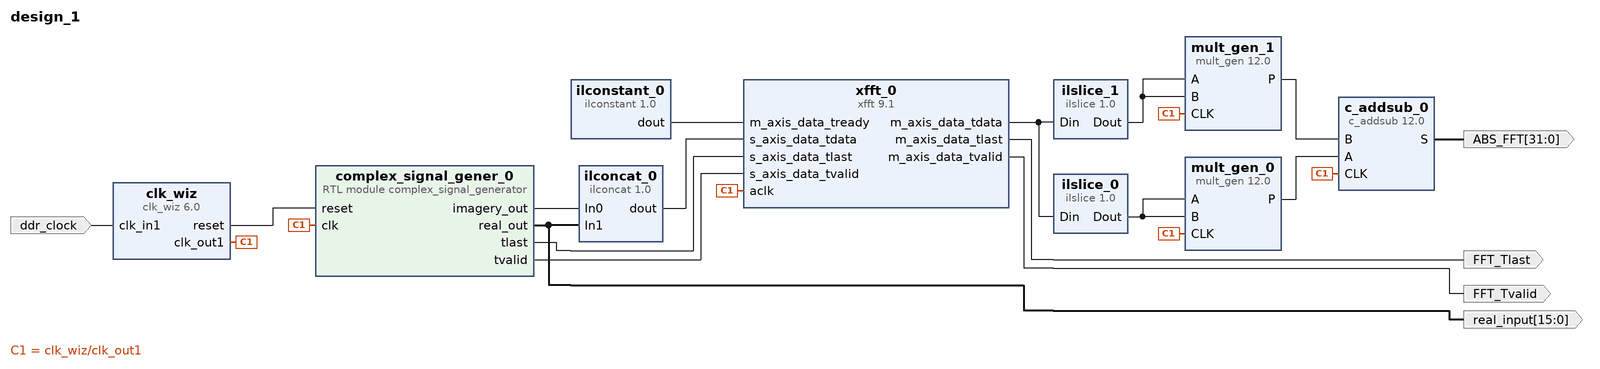
[diagram p0: block diagram of the top level]
# Vivado block design design_1, xc7s25csga324-1, Vivado 2025.1
create_bd_design design_1

create_bd_port -dir O -from 31 -to 0 -type data ABS_FFT
create_bd_port -dir O FFT_Tlast
create_bd_port -dir O FFT_Tvalid
create_bd_port -dir O -from 15 -to 0 real_input
create_bd_port -dir I -type clk ddr_clock
set_property -dict {CONFIG.FREQ_HZ 100000000 CONFIG.PHASE 0.0} [get_bd_ports ddr_clock]

create_bd_cell -type ip -vlnv xilinx.com:ip:xfft:9.1 xfft_0
set_property -dict [list \
  CONFIG.butterfly_type use_luts \
  CONFIG.data_format fixed_point \
  CONFIG.implementation_options automatically_select \
  CONFIG.input_width 16 \
  CONFIG.number_of_stages_using_block_ram_for_data_and_phase_factors 4 \
  CONFIG.output_ordering natural_order \
  CONFIG.phase_factor_width 16 \
  CONFIG.run_time_configurable_transform_length false \
  CONFIG.super_sample_rates 1 \
  CONFIG.target_clock_frequency 100 \
  CONFIG.target_data_throughput 100 \
  CONFIG.transform_length 2048 \
] [get_bd_cells xfft_0]
create_bd_cell -type inline_hdl -vlnv xilinx.com:inline_hdl:ilconcat:1.0 ilconcat_0
create_bd_cell -type inline_hdl -vlnv xilinx.com:inline_hdl:ilconstant:1.0 ilconstant_0
create_bd_cell -type inline_hdl -vlnv xilinx.com:inline_hdl:ilslice:1.0 ilslice_0
set_property -dict {CONFIG.DIN_FROM 31 CONFIG.DIN_TO 16} [get_bd_cells ilslice_0]
create_bd_cell -type inline_hdl -vlnv xilinx.com:inline_hdl:ilslice:1.0 ilslice_1
set_property -dict {CONFIG.DIN_FROM 15} [get_bd_cells ilslice_1]
create_bd_cell -type ip -vlnv xilinx.com:ip:mult_gen:12.0 mult_gen_0
set_property -dict [list \
  CONFIG.PortAType Signed \
  CONFIG.PortAWidth 16 \
  CONFIG.PortBType Signed \
  CONFIG.PortBWidth 16 \
] [get_bd_cells mult_gen_0]
create_bd_cell -type ip -vlnv xilinx.com:ip:mult_gen:12.0 mult_gen_1
set_property -dict [list \
  CONFIG.PortAType Signed \
  CONFIG.PortAWidth 16 \
  CONFIG.PortBType Signed \
  CONFIG.PortBWidth 16 \
] [get_bd_cells mult_gen_1]
create_bd_cell -type ip -vlnv xilinx.com:ip:c_addsub:12.0 c_addsub_0
set_property -dict [list \
  CONFIG.A_Type Signed \
  CONFIG.A_Width 32 \
  CONFIG.B_Type Signed \
  CONFIG.B_Value 00000000000000000000000000000000 \
  CONFIG.B_Width 32 \
  CONFIG.Latency 1 \
  CONFIG.Out_Width 32 \
] [get_bd_cells c_addsub_0]
create_bd_cell -type module -reference complex_signal_generator complex_signal_gener_0
create_bd_cell -type ip -vlnv xilinx.com:ip:clk_wiz:6.0 clk_wiz
set_property -dict [list \
  CONFIG.CLKOUT1_REQUESTED_OUT_FREQ 100.0 \
  CONFIG.CLK_IN1_BOARD_INTERFACE ddr_clock \
  CONFIG.USE_BOARD_FLOW true \
] [get_bd_cells clk_wiz]

# ---- connections ----

connect_bd_net [get_bd_pins clk_wiz/reset] [get_bd_pins complex_signal_gener_0/reset]
connect_bd_net [get_bd_pins c_addsub_0/S] [get_bd_ports ABS_FFT]
connect_bd_net [get_bd_pins complex_signal_gener_0/imagery_out] [get_bd_pins ilconcat_0/In0]
connect_bd_net [get_bd_pins complex_signal_gener_0/real_out] [get_bd_pins ilconcat_0/In1] [get_bd_ports real_input]
connect_bd_net [get_bd_pins complex_signal_gener_0/tlast] [get_bd_pins xfft_0/s_axis_data_tlast]
connect_bd_net [get_bd_pins complex_signal_gener_0/tvalid] [get_bd_pins xfft_0/s_axis_data_tvalid]
connect_bd_net [get_bd_ports ddr_clock] [get_bd_pins clk_wiz/clk_in1]
connect_bd_net [get_bd_pins ilconcat_0/dout] [get_bd_pins xfft_0/s_axis_data_tdata]
connect_bd_net [get_bd_pins ilconstant_0/dout] [get_bd_pins xfft_0/m_axis_data_tready]
connect_bd_net [get_bd_pins ilslice_0/Dout] [get_bd_pins mult_gen_0/A] [get_bd_pins mult_gen_0/B]
connect_bd_net [get_bd_pins ilslice_1/Dout] [get_bd_pins mult_gen_1/A] [get_bd_pins mult_gen_1/B]
connect_bd_net [get_bd_pins mult_gen_0/P] [get_bd_pins c_addsub_0/A]
connect_bd_net [get_bd_pins mult_gen_1/P] [get_bd_pins c_addsub_0/B]
connect_bd_net -net sim_clk_gen_0_clk [get_bd_pins clk_wiz/clk_out1] \
  [get_bd_pins xfft_0/aclk] [get_bd_pins mult_gen_0/CLK] [get_bd_pins mult_gen_1/CLK] [get_bd_pins c_addsub_0/CLK] \
  [get_bd_pins complex_signal_gener_0/clk]
connect_bd_net [get_bd_pins xfft_0/m_axis_data_tdata] [get_bd_pins ilslice_0/Din] [get_bd_pins ilslice_1/Din]
connect_bd_net [get_bd_pins xfft_0/m_axis_data_tlast] [get_bd_ports FFT_Tlast]
connect_bd_net [get_bd_pins xfft_0/m_axis_data_tvalid] [get_bd_ports FFT_Tvalid]

validate_bd_design
save_bd_design
